# Altium schematic sheet RadioModule.SchDoc: Radio
size A3; DrawnBy: Liam Hare; Address1: ECE Department; Address2: University of Canterbury; Address3: Christchurch 8041; Address4: New Zealand; Revision: 1; SheetNumber: 2; SheetTotal: 4
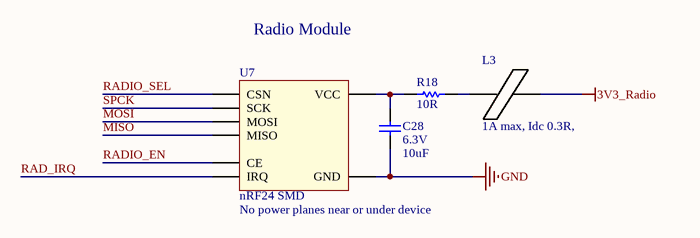
[diagram p0: RadioModule.SchDoc]

## Parts
C28  Voltage - Rated: 6.3V  [CAPC1608L]  (hidden comment: 10uF)
L3  1A max, Idc 0.3R,  [INDC3216L]
R18  10R  [RESC1608L]
U7  nRF24 SMD  Warning: No power planes near or under device  [NRF24]

## Nets
3V3_Radio: L3.2
GND: C28.1 U7.2(GND)
MISO: U7.7(MISO)
MOSI: U7.6(MOSI)
RAD_IRQ: U7.8(IRQ)
RADIO_EN: U7.3(CE)
RADIO_SEL: U7.4(CSN)
SPCK: U7.5(SCK)
NetC28_2: C28.2 R18.1 U7.1(VCC)
NetL3_1: L3.1 R18.2

## Notes on the sheet
- Radio Module
- Title
- Drawn by:
- Date:
- Time:
- Revision:
- Sheet
- of
- File:

## Library data of the parts
C28 = CC_10uF_0603: CAP CER 10UF X5R +-20% 6V3 0603; Supplier: ECE Dept; Storage Location: PCB Assembly WS; Value: 10uF
L3 = IN_Ferrite-Bead: Ferrite Bead, Rdc 0.3R, Z100MHZ 600R, Imax 1A, SMD 1206; Manufacturer: FAIR-RITE; Manufacturer PN: 2512066017Y1; DC Current Rating: 1; DC Resistance Max: 0.08; Ferrite Case Style: 1206 ^3216 Metric]; Frequency Range: 50MHz to 1; Impedance: 600; Impedance Tolerance: ± 25%; Supplier: ECE Dept; Storage Location: PCB Assembly WS; Ferrite Mounting: SMD; Supplier 1: Farnell; Supplier Part Number 1: 1612060; Manufacturer Part Number: 2512066017Y1; Value: 1A max, Idc 0.3R,
R18 = RS_10R: RES 10 OHM 1/10W 5% 0603 SMD; Storage Location: PCB Assembly WS; Supplier: ECE Dept; Value: 10R
U7 = NRF24: nRF24 SMD Module